# EAGLE schematic line_sensor_board (EAGLE 7.2.0)
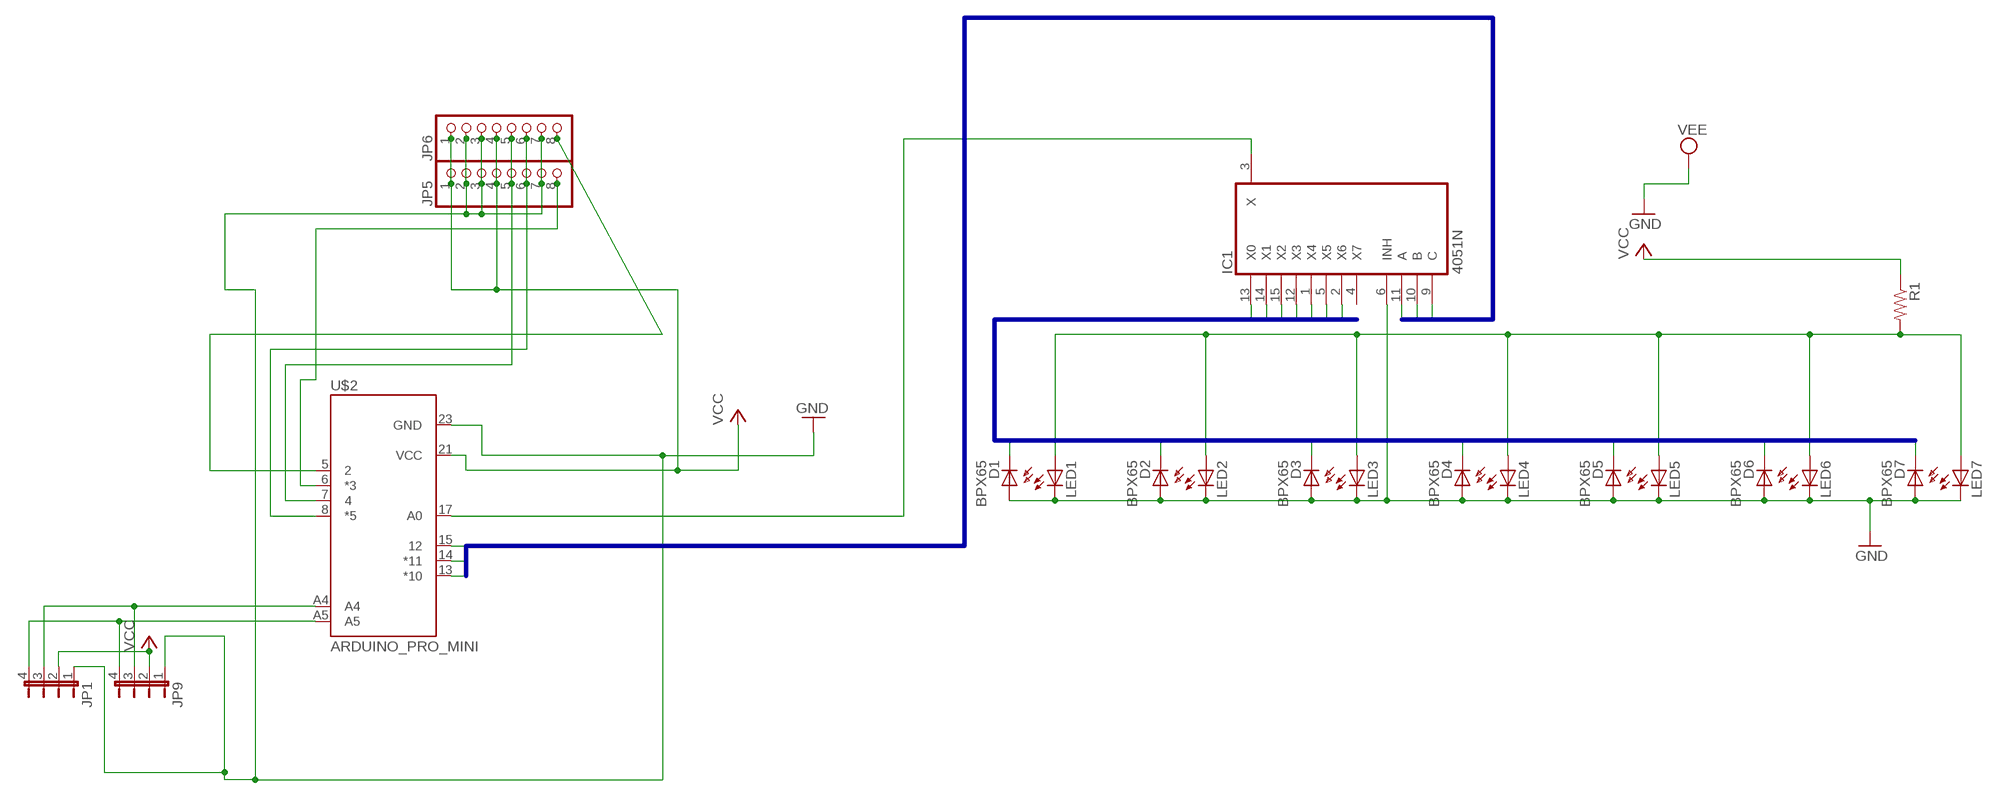
[diagram p0: schematic, sheet 1]

## Parts
D1  BPX65  [BPX65]
D2  BPX65  [BPX65]
D3  BPX65  [BPX65]
D4  BPX65  [BPX65]
D5  BPX65  [BPX65]
D6  BPX65  [BPX65]
D7  BPX65  [BPX65]
IC1  4051N  [DIL16]
JP1  JP4E  [JP4]
JP5  PINHD-1X8  [1X08]
JP6  PINHD-1X8  [1X08]
JP9  JP4E  [JP4]
LED1  LED3MM  [LED3MM]
LED2  LED3MM  [LED3MM]
LED3  LED3MM  [LED3MM]
LED4  LED3MM  [LED3MM]
LED5  LED3MM  [LED3MM]
LED6  LED3MM  [LED3MM]
LED7  LED3MM  [LED3MM]
R1  R-US_0204/5  [0204/5]
U$2  ARDUINO_PRO_MINI  [ARDUINO_PRO_MINI]

## Nets
A1: IC1.11(A) U$2.15
A2: IC1.10(B) U$2.14(*11)
A3: IC1.9(C) U$2.13(*10)
B1: D7.K(C) IC1.13(X0)
B2: D6.K(C) IC1.14(X1)
B3: D5.K(C) IC1.15(X2)
B4: D4.K(C) IC1.12(X3)
B5: D3.K(C) IC1.1(X4)
B6: D2.K(C) IC1.5(X5)
B7: D1.K(C) IC1.2(X6)
GND: D1.A D2.A D3.A D4.A D5.A D6.A D7.A IC1.6(INH) JP1.1 JP5.2 JP5.3 JP5.7 JP6.2 JP6.3 JP6.7 JP9.1 LED1.K(C) LED2.K(C) LED3.K(C) LED4.K(C) LED5.K(C) LED6.K(C) LED7.K(C) U$2.23(GND) ; supply symbol labelled VEE
N$1: IC1.3(X) U$2.17(A0)
N$2: JP1.3 JP9.3 U$2.A4
N$3: JP1.4 JP9.4 U$2.A5
N$4: JP5.5 JP6.5 U$2.7
N$5: JP5.6 JP6.6 U$2.8(*5)
N$6: JP5.8 U$2.6(*3)
N$7: LED1.A LED2.A LED3.A LED4.A LED5.A LED6.A LED7.A R1.2
N$9: JP6.8 U$2.5
VCC: JP1.2 JP5.1 JP5.4 JP6.1 JP6.4 JP9.2 R1.1 U$2.21(VCC)
Unconnected: IC1.4(X7)

## Buses
B[1..7]
A[1..3]

## Power pins joined to a net without a drawn wire
GND: IC1.8(GND)
VCC: IC1.16(VCC)
VEE: IC1.7(VEE)

## Library data of the parts
D1-D7 = opto-trans-siemens:BPX65: PHOTO DIODE; MPN: BPX65.; OC_FARNELL: 327451; OC_NEWARK: 06WX2764
IC1 = 40xx:4051: 8-channel ANALOG MULTIPLEXER
JP1 JP9 = jumper:JP4E: JUMPER
JP5 JP6 = pinhead:PINHD-1X8: PIN HEADER
LED1-LED7 = led:LED: LED OSRAM: - CHIPLED LG R971, LG N971, LY N971, LG Q971, LY Q971, LO R971, LY R971 LH N974, LH R974 LS Q976, LO Q976, LY Q976 LO Q996 - Hyper CHIPLED LW Q18S LB Q993, LB Q99A, LB R99A - SideLED LS A670, LO A670, LY A670, LG A670, LP A670 LB A673, LV A673, LT A673, LW A673 LH A674 LY A675 LS A676, LA A676, LO A676, LY A676, LW A676 LS A679, LY A679, LG A679 - Hyper Micro SIDELED® LS Y876, LA Y876, LO Y876, LY Y876 LT Y87S - SmartLED LW L88C, LW L88S LB L89C, LB L89S, LG L890 LS L89K, LO L89K, LY L89K LS L896, LA L896, LO L896, LY L896 - TOPLED LS T670, LO T670, LY T670, LG T670, LP T670 LSG T670, LSP T670, LSY T670, LOP T670, LYG T670 LG T671, LOG T671, LSG T671 LB T673, LV T673, LT T673, LW T673 LH T674 LS T676, LA T676, LO T676, LY T676, LB T676, LH T676, LSB T676, LW T676 LB T67C, LV T67C, LT T67C, LS T67K, LO T67K, LY T67K, LW E67C LS E67B, LA E67B, LO E67B, LY E67B, LB E67C, LV E67C, LT E67C LW T67C LS T679, LY T679, LG T679 LS T770, LO T770, LY T770, LG T770, LP T770 LB T773, LV T773, LT T773, LW T773 LH T774 LS E675, LA E675, LY E675, LS T675 LS T776, LA T776, LO T776, LY T776, LB T776 LHGB T686 LT T68C, LB T68C - Hyper Mini TOPLED® LB M676 - Mini TOPLED Santana® LG M470 LS M47K, LO M47K, LY M47K Source: http://www.osram.convergy.de LUXEON: - LUMILED® LXK2-PW12-R00, LXK2-PW12-S00, LXK2-PW14-U00, LXK2-PW14-V00 LXK2-PM12-R00, LXK2-PM12-S00, LXK2-PM14-U00 LXK2-PE12-Q00, LXK2-PE12-R00, LXK2-PE12-S00, LXK2-PE14-T00, LXK2-PE14-U00 LXK2-PB12-K00, LXK2-PB12-L00, LXK2-PB12-M00, LXK2-PB14-N00, LXK2-PB14-P00, LXK2-PB14-Q00 LXK2-PR12-L00, LXK2-PR12-M00, LXK2-PR14-Q00, LXK2-PR14-R00 LXK2-PD12-Q00, LXK2-PD12-R00, LXK2-PD12-S00 LXK2-PH12-R00, LXK2-PH12-S00 LXK2-PL12-P00, LXK2-PL12-Q00, LXK2-PL12-R00 Source: www.luxeon.com KINGBRIGHT: KA-3528ASYC Source: www.kingbright.com
R1 = rcl:R-US_: RESISTOR, American symbol
U$2 = SparkFun-Boards:ARDUINO_PRO_MINI